# Altium project mcu.PrjPcb (part 2 of 2)

## Sheet misc.SchDoc
size 381 x 241 mm; SheetNumber: 4; SheetTotal: 5
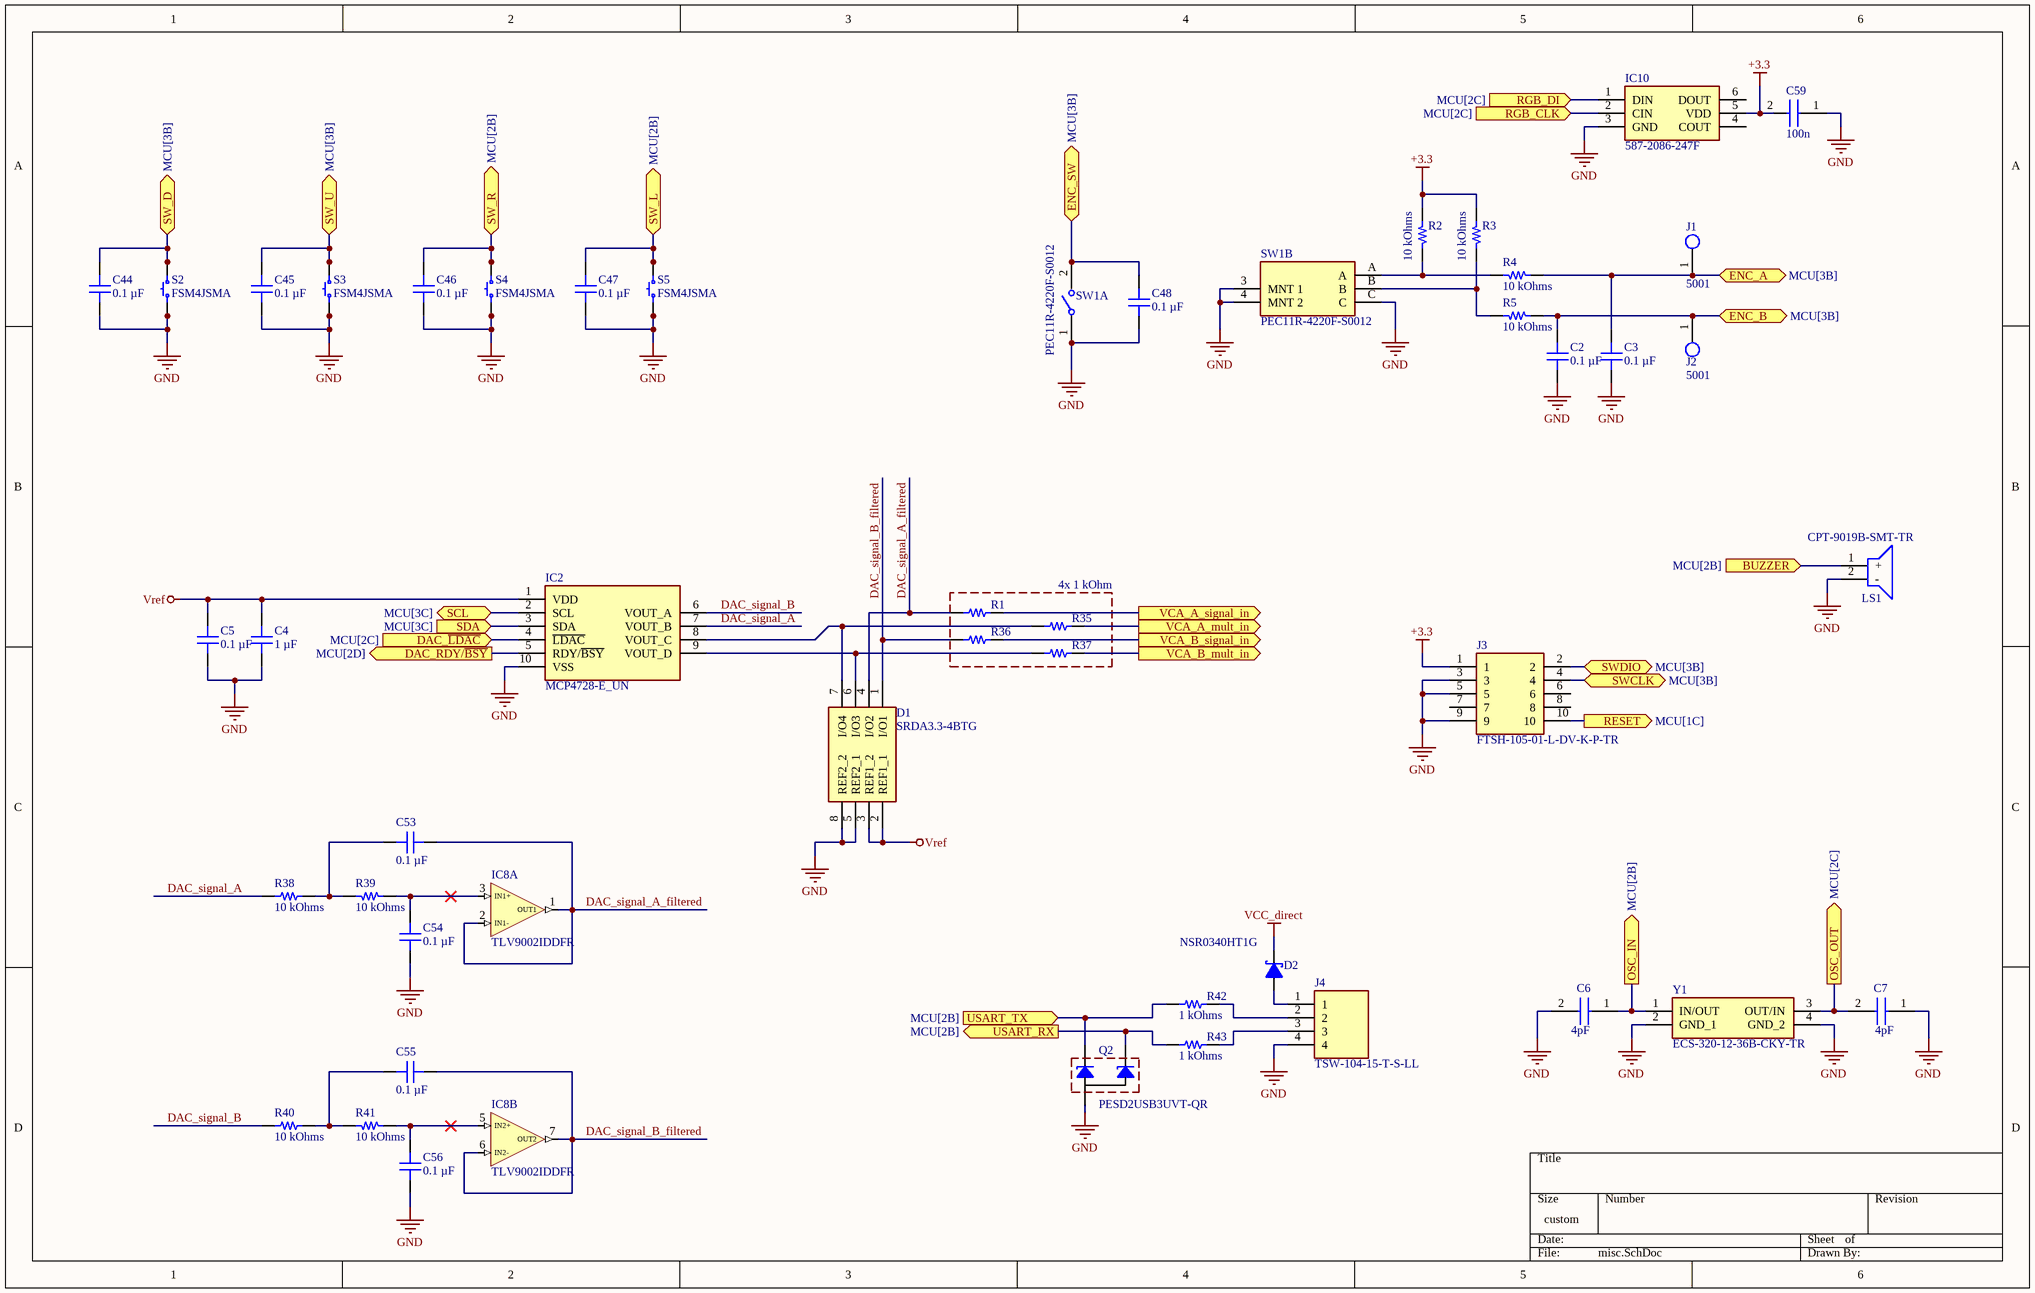
[diagram p3: misc.SchDoc]

### Parts
C2  0.1 µF  [CAP 1206_3216 - 0.8MM]
C3  0.1 µF  [CAP 1206_3216 - 0.8MM]
C4  1 µF  [CAP 1206_3216 - 0.8MM]
C5  0.1 µF  [CAP 1206_3216 - 0.8MM]
C6  4pF  [CAPC1608X80N]
C7  4pF  [CAPC1608X80N]
C44  0.1 µF  [CAP 1206_3216 - 0.8MM]
C45  0.1 µF  [CAP 1206_3216 - 0.8MM]
C46  0.1 µF  [CAP 1206_3216 - 0.8MM]
C47  0.1 µF  [CAP 1206_3216 - 0.8MM]
C48  0.1 µF  [CAP 1206_3216 - 0.8MM]
C53  0.1 µF  [CAP 1206_3216 - 0.8MM]
C54  0.1 µF  [CAP 1206_3216 - 0.8MM]
C55  0.1 µF  [CAP 1206_3216 - 0.8MM]
C56  0.1 µF  [CAP 1206_3216 - 0.8MM]
C59  100n  [C0805]
D1  SRDA3.3-4BTG  [SOIC8-127P600X175-8N]
D2  NSR0340HT1G  [SOD2512X110N]
IC2  MCP4728-E_UN  [SOP50P490X110-10N]
IC8  TLV9002IDDFR  [SOT65P280X110-8N]  (parts A,B of 3)
IC10  587-2086-247F  [5872086247F]
J1  5001  [FP-5001-MFG]
J2  5001  [FP-5001-MFG]
J3  FTSH-105-01-L-DV-K-P-TR  [FTSH-105-XX-YYY-DV-K-P-TR]
J4  TSW-104-15-T-S-LL  [HDRV4W64P254_1X4_1016X241X1575P]
LS1  CPT-9019B-SMT-TR  [CPT9019BSMTTR]
Q2  PESD2USB3UVT-QR  [SOT95P230X110-3N]
R1  1 kOhms  [YAGEO RES 1206_3216]  (value not drawn)
R2  10 kOhms  [YAGEO RES 1206_3216]
R3  10 kOhms  [YAGEO RES 1206_3216]
R4  10 kOhms  [YAGEO RES 1206_3216]
R5  10 kOhms  [YAGEO RES 1206_3216]
R35  1 kOhms  [YAGEO RES 1206_3216]  (value not drawn)
R36  1 kOhms  [YAGEO RES 1206_3216]  (value not drawn)
R37  1 kOhms  [YAGEO RES 1206_3216]  (value not drawn)
R38  10 kOhms  [RES 1206_3216]
R39  10 kOhms  [YAGEO RES 1206_3216]
R40  10 kOhms  [RES 1206_3216]
R41  10 kOhms  [YAGEO RES 1206_3216]
R42  1 kOhms  [YAGEO RES 1206_3216]
R43  1 kOhms  [YAGEO RES 1206_3216]
S2  FSM4JSMA  [TE FSM4JSMA]
S3  FSM4JSMA  [TE FSM4JSMA]
S4  FSM4JSMA  [TE FSM4JSMA]
S5  FSM4JSMA  [TE FSM4JSMA]
SW1  PEC11R-4220F-S0012  [FP-PEC11R-4220F-S0012-MFG]  (parts A,B of 2)
Y1  ECS-320-12-36B-CKY-TR  [ECS240836QAESTR]

### Blocks framed on the sheet
4x 1 kOhm: R1 R35-R37

### Ports
BUZZER (in, see MCU[2B]), DAC_RDY/~{BSY} (out, see MCU[2D]), DAC_~{LDAC} (in, see MCU[2C]), ENC_A (bidir, see MCU[3B]), ENC_B (bidir, see MCU[3B]), ENC_SW (bidir, see MCU[3B]), OSC_IN (out, see MCU[2B]), OSC_OUT (out, see MCU[2C]), RESET (out, see MCU[1C]), RGB_CLK (in, see MCU[2C]), RGB_DI (in, see MCU[2C]), SCL (bidir, see MCU[3C]), SDA (in, see MCU[3C]), SW_D (bidir, see MCU[3B]), SW_L (bidir, see MCU[2B]), SW_R (bidir, see MCU[2B]), SW_U (bidir, see MCU[3B]), SWCLK (bidir, see MCU[3B]), SWDIO (bidir, see MCU[3B]), USART_RX (out, see MCU[2B]), USART_TX (in, see MCU[2B]), VCA_A_mult_in (out), VCA_A_signal_in (out), VCA_B_mult_in (out), VCA_B_signal_in (out)

### Nets
+3.3: C59.2 IC10.5(VDD) J3.1 R2.1 R3.1
GND: C2.1 C3.1 C4.1 C5.1 C6.2 C7.1 C44.1 C45.1 C46.1 C47.1 C48.1 C54.2 C56.2 C59.1 D1.5(REF2_1) D1.8(REF2_2) IC2.10(VSS) IC10.3(GND) J3.3 J3.5 J3.9 J4.4 LS1.2(-) Q2.3(CA) S2.1 S2.2 S3.1 S3.2 S4.1 S4.2 S5.1 S5.2 SW1.1 SW1.3(MNT_1) SW1.4(MNT_2) SW1.C Y1.2(GND_1) Y1.4(GND_2)
VCC_direct: D2.1(C)
Vref: C4.2 C5.2 D1.2(REF1_1) D1.3(REF1_2) IC2.1(VDD)
DAC_signal_A: IC2.7(VOUT_B) R38.1
DAC_signal_A_filtered: C53.1 D1.4(I/O2) IC8.1(OUT1) IC8.2(IN1-) R1.2
DAC_signal_B: IC2.6(VOUT_A) R40.1
DAC_signal_B_filtered: C55.1 D1.1(I/O1) IC8.6(IN2-) IC8.7(OUT2) R36.2
NetC1_2: J3.10 ; port RESET
NetC2_2: C2.2 J2.1 R5.2 ; port ENC_B
NetC3_2: C3.2 J1.1 R4.2 ; port ENC_A
NetC6_1: C6.1 Y1.1(IN/OUT) ; port OSC_IN
NetC7_2: C7.2 Y1.3(OUT/IN) ; port OSC_OUT
NetC44_2: C44.2 S2.3 S2.4 ; port SW_D
NetC45_2: C45.2 S3.3 S3.4 ; port SW_U
NetC46_2: C46.2 S4.3 S4.4 ; port SW_R
NetC47_2: C47.2 S5.3 S5.4 ; port SW_L
NetC48_2: C48.2 SW1.2 ; port ENC_SW
NetC53_2: C53.2 R38.2 R39.2
NetC54_1: C54.1 IC8.3(IN1+) R39.1
NetC55_2: C55.2 R40.2 R41.2
NetC56_1: C56.1 IC8.5(IN2+) R41.1
NetD1_6: D1.6(I/O3) IC2.9(VOUT_D) R37.2
NetD1_7: D1.7(I/O4) IC2.8(VOUT_C) R35.2
NetD2_2: D2.2(A) J4.1
NetIC1_1: LS1.1(+) ; port BUZZER
NetIC1_11: IC10.1(DIN) ; port RGB_DI
NetIC1_12: IC10.2(CIN) ; port RGB_CLK
NetIC1_13: IC2.4(~{LDAC}) ; port DAC_~{LDAC}
NetIC1_14: IC2.5(RDY/~{BSY}) ; port DAC_RDY/~{BSY}
NetIC1_25: IC2.2(SCL) ; port SCL
NetIC1_26: IC2.3(SDA) ; port SDA
NetIC1_35: J3.2 ; port SWDIO
NetIC1_36: J3.4 ; port SWCLK
NetIC1_45: Q2.1(K1) R42.2 ; port USART_TX
NetIC1_46: Q2.2(K2) R43.2 ; port USART_RX
NetJ4_2: J4.2 R42.1
NetJ4_3: J4.3 R43.1
NetR1_1: R1.1 ; port VCA_A_signal_in
NetR2_2: R2.2 R4.1 SW1.A
NetR3_2: R3.2 R5.1 SW1.B
NetR35_1: R35.1 ; port VCA_A_mult_in
NetR36_1: R36.1 ; port VCA_B_signal_in
NetR37_1: R37.1 ; port VCA_B_mult_in

Not connected (* = marked no-connect by the designer): IC10 4(COUT) 6(DOUT); J3 6 7 8

### Library data of the parts
C2 C3 C5 C44-C48 C53-C56 = 885012208087: CAP CER 0.1UF 50V X7R 1206; manufacturer: Würth Elektronik; Tolerance: ±10%; Part Number: 885012208087; Capacitance: 0.1 µF; Applications: General Purpose; componentlink1description: Datasheet; componentlink1url: https://katalog.we-online.de/pbs/datasheet/885012208087.pdf; componentlink2description: DigiKey Link; componentlink2url: https://www.digikey.com/en/products/detail/würth-elektronik/885012208087/5453982; Device Package: 1206 (3216 Metric); lastupdated: 6/4/2024 19:10:27; Lifecycle Status: Active; Minimum Order: 1; Mounting Type: Surface Mount, MLCC; Operating Temperature: -55°C ~ 125°C; Package / Case: 1206 (3216 Metric); packaging: TapeAndReel; partid: 20879; Part Status: Active; price: 0.06; series: WCAP-CSGP; Size / Dimension: 0.126" L x 0.063" W (3.20mm x 1.60mm); Supplier 1: DigiKey; Supplier Part Number 1: 732-8127-1-ND; Temperature Coefficient: X7R; Thickness (Max): 0.035" (0.90mm); value: 0.1 µF; Voltage - Rated: 50V
C4 = 885012208093: CAP CER 1UF 50V X7R 1206; manufacturer: Würth Elektronik; Tolerance: ±10%; Part Number: 885012208093; Capacitance: 1 µF; Applications: General Purpose; componentlink1description: Datasheet; componentlink1url: https://katalog.we-online.de/pbs/datasheet/885012208093.pdf; componentlink2description: DigiKey Link; componentlink2url: https://www.digikey.com/en/products/detail/würth-elektronik/885012208093/5453432; Device Package: 1206 (3216 Metric); lastupdated: 6/4/2024 19:10:33; Lifecycle Status: Active; Minimum Order: 1; Mounting Type: Surface Mount, MLCC; Operating Temperature: -55°C ~ 125°C; Package / Case: 1206 (3216 Metric); packaging: TapeAndReel; partid: 39665; Part Status: Active; price: 0.10; series: WCAP-CSGP; Size / Dimension: 0.126" L x 0.063" W (3.20mm x 1.60mm); Supplier 1: DigiKey; Supplier Part Number 1: 732-7577-1-ND; Temperature Coefficient: X7R; Thickness (Max): 0.075" (1.90mm); value: 1 µF; Voltage - Rated: 50V
C6 C7 = C1608C0G1H040C080AA: Capacitor; Manufacturer_Name: TDK; Datasheet Link: https://product.tdk.com/info/en/catalog/datasheets/mlcc_commercial_midvoltage_en.pdf; Height: 0.8mm; Manufacturer_Part_Number: C1608C0G1H040C080AA; Arrow Part Number: C1608C0G1H040C080AA; Arrow Price/Stock: https://www.arrow.com/en/products/c1608c0g1h040c080aa/tdk
C59 = C0805C104K3RACTU: Capacitor; Manufacturer_Name: KEMET; Datasheet Link: https://content.kemet.com/datasheets/KEM_C1002_X7R_SMD.pdf; Height: 1.1mm; Manufacturer_Part_Number: C0805C104K3RACTU; Mouser Part Number: 80-C0805C104K3R; Mouser Price/Stock: https://www.mouser.co.uk/ProductDetail/KEMET/C0805C104K3RACTU?qs=zZwvocWqSRjmUvfNxkIN%2Fg%3D%3D; Arrow Part Number: C0805C104K3RACTU; Arrow Price/Stock: https://www.arrow.com/en/products/c0805c104k3ractu/kemet-corporation
D1 = SRDA3.3-4BTG: TVS Diode (Bi-directional); Manufacturer_Name: LITTELFUSE; Datasheet Link: https://www.littelfuse.com/~/media/electronics/datasheets/tvs_diode_arrays/littelfuse_tvs_diode_array_srda3_3_datasheet.pdf.pdf; Height: 1.75mm; Manufacturer_Part_Number: SRDA3.3-4BTG; Mouser Part Number: 576-SRDA3.3-4BTG; Mouser Price/Stock: https://www.mouser.co.uk/ProductDetail/Littelfuse/SRDA3.3-4BTG?qs=wqPJ3MBjhrh9DaqZL3Nnvw%3D%3D; Arrow Part Number: SRDA3.3-4BTG; Arrow Price/Stock: https://www.arrow.com/en/products/srda3.3-4btg/littelfuse?utm_currency=USD&region=nac
D2 = NSR0340HT1G: Diode; Manufacturer_Name: onsemi; Datasheet Link: https://www.onsemi.com/pub/Collateral/NSR0340H-D.PDF; Height: 1.1mm; Manufacturer_Part_Number: NSR0340HT1G; Mouser Part Number: 863-NSR0340HT1G; Mouser Price/Stock: https://www.mouser.co.uk/ProductDetail/onsemi/NSR0340HT1G?qs=agb4oTp1Mj%2FMC6G4Sgc%2FTQ%3D%3D; Arrow Part Number: NSR0340HT1G; Arrow Price/Stock: https://www.arrow.com/en/products/nsr0340ht1g/on-semiconductor?utm_currency=USD&region=nac
IC2 = MCP4728-E_UN: Integrated Circuit; Manufacturer_Name: Microchip; Manufacturer_Part_Number: MCP4728-E/UN; Datasheet Link: http://ww1.microchip.com/downloads/en/DeviceDoc/22187E.pdf; Height: 1.1mm; Mouser Part Number: 579-MCP4728-E/UN; Mouser Price/Stock: https://www.mouser.co.uk/ProductDetail/Microchip-Technology/MCP4728-E-UN?qs=E6wAi2XWqcP2zTenScklGA%3D%3D; Arrow Part Number: MCP4728-E/UN; Arrow Price/Stock: https://www.arrow.com/en/products/mcp4728-eun/microchip-technology?utm_currency=USD&region=nac
IC8 = TLV9002IDDFR: Integrated Circuit; Manufacturer_Name: Texas Instruments; Datasheet Link: https://www.ti.com/lit/gpn/TLV9002; Height: 1.1mm; Manufacturer_Part_Number: TLV9002IDDFR; Mouser Part Number: 595-TLV9002IDDFR; Mouser Price/Stock: https://www.mouser.co.uk/ProductDetail/Texas-Instruments/TLV9002IDDFR?qs=mAH9sUMRCtuVJ6NmNV%252Bgrw%3D%3D; Arrow Part Number: TLV9002IDDFR; Arrow Price/Stock: https://www.arrow.com/en/products/tlv9002iddfr/texas-instruments?utm_currency=USD&region=nac
IC10 = 587-2086-247F: Integrated Circuit; Manufacturer_Name: Dialight; Datasheet Link: https://s3-us-west-2.amazonaws.com/catsy.557/Dialight_datasheet_587-2086-247F_Addressable_RGB.pdf; Height: 1mm; Manufacturer_Part_Number: 587-2086-247F; Mouser Part Number: 645-587-2086-247F; Mouser Price/Stock: https://www.mouser.co.uk/ProductDetail/Dialight/587-2086-247F?qs=iLKYxzqNS76TDIp9wEi56Q%3D%3D
J1 J2 = CMP-2000-05181-2: PC TEST POINT MINIATURE BLACK; Body Material: Bronze; Plating: Silver; Inside Diameter: 1.27mm; Hole Diameter: 1.6mm; Number of Ports: 1; Outside Diameter: 2.54mm; Insulation: Insulated; Insulation Material: Nylon; Mount: Through Hole; RoHS Compliant: Yes; Series: THM; Height: 0.3inch; Termination: Through Hole; Material: Nylon; Packaging: Bulk; Contact Material: Bronze; REACH SVHC: No SVHC; Contact Plating: Silver; Orientation: Straight; Lead Free: Lead Free; Package Quantity: 100; Length: 7.62mm; Flammability Rating: UL94 V-0; Number of Contacts: 1; Diameter: 2.54mm; Housing Color: Black; Color: Black
J3 = FTSH-105-01-L-DV-K-P-TR: Connector; Manufacturer_Name: SAMTEC; Datasheet Link: http://suddendocs.samtec.com/prints/ftsh-1xx-xx-xxx-dv-xxx-xxx-mkt.pdf; Manufacturer_Part_Number: FTSH-105-01-L-DV-K-P-TR; Mouser Part Number: 200-FTSH10501LDVKPTR; Mouser Price/Stock: https://www.mouser.co.uk/ProductDetail/Samtec/FTSH-105-01-L-DV-K-P-TR?qs=fnpEE5GccuMUjCRgxv4voQ%3D%3D; Arrow Part Number: FTSH-105-01-L-DV-K-P-TR; Arrow Price/Stock: https://www.arrow.com/en/products/ftsh-105-01-l-dv-k-p-tr/samtec?utm_currency=USD&region=europe
J4 = TSW-104-15-T-S-LL: Connector; Manufacturer_Name: SAMTEC; Datasheet Link: http://suddendocs.samtec.com/catalog_english/tsw_th.pdf; Height: 15.75mm; Manufacturer_Part_Number: TSW-104-15-T-S-LL; Mouser Part Number: 200-TSW10415TSLL; Mouser Price/Stock: https://www.mouser.co.uk/ProductDetail/Samtec/TSW-104-15-T-S-LL?qs=rU5fayqh%252BE1Oq%252BEC9ZwiVQ%3D%3D
LS1 = CPT-9019B-SMT-TR: Loudspeaker or Buzzer; Manufacturer_Name: Same Sky; Datasheet Link: https://www.sameskydevices.com/product/resource/supplyframepdf/cpt-9019b-smt-tr.pdf; Height: 2.1mm; Manufacturer_Part_Number: CPT-9019B-SMT-TR; Mouser Part Number: 179-CPT-9019B-SMT-TR; Mouser Price/Stock: https://www.mouser.co.uk/ProductDetail/CUI-Devices/CPT-9019B-SMT-TR?qs=3Rah4i%252BhyCGQOzp5C27TLw%3D%3D
Q2 = PESD2USB3UVT-QR: Transistor; Manufacturer_Name: Nexperia; Datasheet Link: https://assets.nexperia.com/documents/data-sheet/PESD2USB3UVT-Q.pdf; Height: 1.1mm; Manufacturer_Part_Number: PESD2USB3UVT-QR; Mouser Part Number: 771-PESD2USB3UVT-QR; Mouser Price/Stock: https://www.mouser.co.uk/ProductDetail/Nexperia/PESD2USB3UVT-QR?qs=3Rah4i%252BhyCFPJOQFghMZ%252BQ%3D%3D; Arrow Part Number: PESD2USB3UVT-QR; Arrow Price/Stock: https://www.arrow.com/en/products/pesd2usb3uvt-qr/nexperia?utm_currency=USD&region=europe
R1 R35-R37 R42 R43 = RT1206FRE071KL: RES SMD 1K OHM 1% 1/4W 1206; Manufacturer: Yageo; Power (Watts): 0.25W, 1/4W; Temperature Coefficient: ±50ppm/°C; Part Number: RT1206FRE071KL; ComponentLink1Description: Datasheet; ComponentLink1URL: https://www.yageo.com/upload/media/product/productsearch/datasheet/rchip/PYu-RT_1-to-0.01_RoHS_L_11.pdf; ComponentLink2Description: DigiKey Link; ComponentLink2URL: https://www.digikey.com/en/products/detail/yageo/RT1206FRE071KL/1083016; Composition: Thin Film; Device Package: 1206 (3216 Metric); Height - Seated (Max): 0.026" (0.65mm); LastUpdated: 7/25/2024 09:21:27; Lifecycle Status: Active; Minimum Order: 1; Number of Terminations: 2; Operating Temperature: -55°C ~ 155°C; Package / Case: 1206 (3216 Metric); Packaging: TapeAndReel; PartId: 40465; Part Status: Active; Price: 0.01; Resistance: 1 kOhms; Series: RT; Size / Dimension: 0.122" L x 0.063" W (3.10mm x 1.60mm); Supplier 1: DigiKey; Supplier Part Number 1: YAG3366CT-ND; Supplier Device Package: 1206; Tolerance: ±1%; Value: 1 kOhms
R2-R5 R39 R41 = RT1206FRE0710KL: RES SMD 10K OHM 1% 1/4W 1206; Manufacturer: Yageo; Power (Watts): 0.25W, 1/4W; Temperature Coefficient: ±50ppm/°C; Part Number: RT1206FRE0710KL; ComponentLink1Description: Datasheet; ComponentLink1URL: https://www.yageo.com/upload/media/product/productsearch/datasheet/rchip/PYu-RT_1-to-0.01_RoHS_L_11.pdf; ComponentLink2Description: DigiKey Link; ComponentLink2URL: https://www.digikey.com/en/products/detail/yageo/RT1206FRE0710KL/1082868; Composition: Thin Film; Device Package: 1206 (3216 Metric); Height - Seated (Max): 0.026" (0.65mm); LastUpdated: 7/25/2024 09:21:28; Lifecycle Status: Active; Minimum Order: 1; Number of Terminations: 2; Operating Temperature: -55°C ~ 155°C; Package / Case: 1206 (3216 Metric); Packaging: TapeAndReel; PartId: 38903; Part Status: Active; Price: 0.01; Resistance: 10 kOhms; Series: RT; Size / Dimension: 0.122" L x 0.063" W (3.10mm x 1.60mm); Supplier 1: DigiKey; Supplier Part Number 1: YAG1242CT-ND; Supplier Device Package: 1206; Tolerance: ±1%; Value: 10 kOhms
R38 R40 = ERA-8AEB103V: RES SMD 10K OHM 0.1% 1/4W 1206; Manufacturer: Panasonic Electronic Components; Power (Watts): 0.25W, 1/4W; Temperature Coefficient: ±25ppm/°C; Part Number: ERA-8AEB103V; ComponentLink1Description: Datasheet; ComponentLink1URL: https://industrial.panasonic.com/cdbs/www-data/pdf/RDM0000/AOA0000C307.pdf; ComponentLink2Description: DigiKey Link; ComponentLink2URL: https://www.digikey.com/en/products/detail/panasonic-electronic-components/ERA-8AEB103V/3070742; Composition: Thin Film; Device Package: 1206 (3216 Metric); Features: Automotive AEC-Q200; Height - Seated (Max): 0.028" (0.70mm); LastUpdated: 2/9/2024 20:54:17; Lifecycle Status: Active; Minimum Order: 1; Number of Terminations: 2; Operating Temperature: -55°C ~ 155°C; Package / Case: 1206 (3216 Metric); Packaging: TapeAndReel; PartId: 33990; Part Status: Active; Price: 0.10; Ratings: AEC-Q200; Resistance: 10 kOhms; Series: ERA-8A; Size / Dimension: 0.126" L x 0.063" W (3.20mm x 1.60mm); Supplier 1: DigiKey; Supplier Part Number 1: P10KBCCT-ND; Supplier Device Package: 1206; Tolerance: ±0.1%; Value: 10 kOhms
S2-S5 = FSM4JSMA: SWITCH TACTILE SPST-NO 0.05A 24V; Manufacturer: TE Connectivity ALCOSWITCH Switches; Actuator Height off PCB, Vertical: 5.00mm; Actuator Orientation: Top Actuated; Actuator Type: Standard; Contact Rating @ Voltage: 0.05A @ 24VDC; Illumination: Non-Illuminated; Operating Force: 160gf; Outline: 6.00mm x 6.00mm; Switch Function: Off-Mom; Part Number: FSM4JSMA; Circuit: SPST-NO; ComponentLink1Description: Datasheet; ComponentLink1URL: https://www.te.com/commerce/DocumentDelivery/DDEController?Action=srchrtrv&DocNm=1308111-1_SWITCHES_CORE_PROGRAM_CATALOG&DocType=CS&DocLang=English; ComponentLink2Description: DigiKey Link; ComponentLink2URL: https://www.digikey.com/en/products/detail/te-connectivity-alcoswitch-switches/FSM4JSMA/525821; LastUpdated: 6/3/2024 20:19:31; Lifecycle Status: Active; Minimum Order: 1; Mounting Type: Surface Mount; Operating Temperature: -35°C ~ 85°C; Packaging: Bulk; Part Status: Active; Price: 0.14; Series: FSMJSMA; Supplier 1: DigiKey; Supplier Part Number 1: 450-1129-ND; Termination Style: Gull Wing
SW1 = PEC11R-4220F-S0012: ROTARY ENCODER MECHANICAL 12PPR; Built in Switch: Yes; Number of Channels: 2; Output Type: Quadrature; Hole Diameter: 7mm; Pulses per Revolution: 12; Termination: PC Pin; Package Quantity: 150; RoHS Compliant: Yes; Mount: Through Hole; Width: 12.5mm; Radiation Hardening: No; Number of Pins: 5; REACH SVHC: No SVHC; Type: Mechanical; Packaging: Bulk; Min Operating Temperature: -30°C; Encoder Type: Mechanical; Height: 13.4mm; Length: 26.5mm; Orientation: Vertical; Max Operating Temperature: 70°C; Series: PEC11R; Detent: Yes
Y1 = ECS-320-12-36B-CKY-TR: Crystal or Oscillator; Manufacturer_Name: ECS; Datasheet Link: https://www.ecsxtal.com/store/pdf/ECX-2236B.pdf; Height: 0mm; Manufacturer_Part_Number: ECS-320-12-36B-CKY-TR; Mouser Part Number: 520-320-12-36B-CKYT; Mouser Price/Stock: https://www.mouser.co.uk/ProductDetail/ECS/ECS-320-12-36B-CKY-TR?qs=l7cgNqFNU1juKISosFzRbg%3D%3D; Arrow Part Number: ECS-320-12-36B-CKY-TR; Arrow Price/Stock: https://www.arrow.com/en/products/ecs-320-12-36b-cky-tr/ecs-international

## Sheet LCD.SchDoc
size A; SheetNumber: 5; SheetTotal: 5
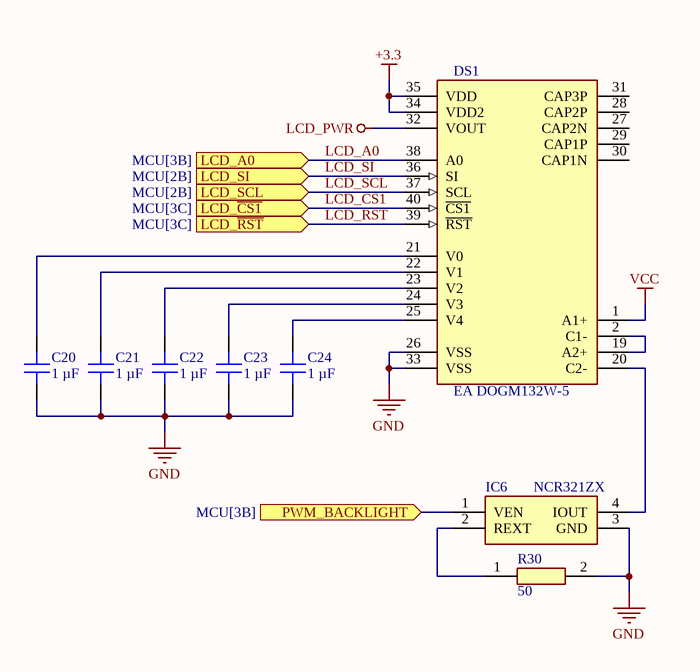
[diagram p4: LCD.SchDoc]

### Parts
C20  1 µF  [CAP 1206_3216 - 0.8MM]
C21  1 µF  [CAP 1206_3216 - 0.8MM]
C22  1 µF  [CAP 1206_3216 - 0.8MM]
C23  1 µF  [CAP 1206_3216 - 0.8MM]
C24  1 µF  [CAP 1206_3216 - 0.8MM]
DS1  EA DOGM132W-5  [FP-EA_DOGM132L-5-MFG]
IC6  NCR321ZX  [SOT230P700X180-4N]
R30  50  [RESC6332X65N]

### Ports
LCD_A0 (in, see MCU[3B]), LCD_SCL (in, see MCU[2B]), LCD_SI (in, see MCU[2B]), LCD_~{CS1} (in, see MCU[3C]), LCD_~{RST} (in, see MCU[3C]), PWM_BACKLIGHT (in, see MCU[3B])

### Nets
+3.3: DS1.34(VDD2) DS1.35(VDD)
GND: C20.1 C21.1 C22.1 C23.1 C24.1 DS1.26(VSS) DS1.33(VSS) IC6.3(GND) R30.2
LCD_PWR: DS1.32(VOUT)
VCC: DS1.1(A1+)
LCD~{_CS}1: DS1.40(~{CS1}) ; port LCD_~{CS1}
LCD~{_RS}T: DS1.39(~{RST}) ; port LCD_~{RST}
LCD_A0: DS1.38(A0) ; port LCD_A0
LCD_SCL: DS1.37(SCL) ; port LCD_SCL
LCD_SI: DS1.36(SI) ; port LCD_SI
NetC20_2: C20.2 DS1.21(V0)
NetC21_2: C21.2 DS1.22(V1)
NetC22_2: C22.2 DS1.23(V2)
NetC23_2: C23.2 DS1.24(V3)
NetC24_2: C24.2 DS1.25(V4)
NetDS1_2: DS1.2(C1-) DS1.19(A2+)
NetDS1_20: DS1.20(C2-) IC6.4(IOUT)
NetIC1_37: IC6.1(VEN) ; port PWM_BACKLIGHT
NetIC6_2: IC6.2(REXT) R30.1

Not connected (* = marked no-connect by the designer): DS1 27(CAP2N) 28(CAP2P) 29(CAP1P) 30(CAP1N) 31(CAP3P)

### Library data of the parts
C20-C24 = 885012208093: as C4 on sheet misc; Part Number: 885012208093; Capacitance: 1 µF; Applications: General Purpose; componentlink1description: Datasheet; componentlink1url: https://katalog.we-online.de/pbs/datasheet/885012208093.pdf; componentlink2description: DigiKey Link; componentlink2url: https://www.digikey.com/en/products/detail/würth-elektronik/885012208093/5453432; Device Package: 1206 (3216 Metric); lastupdated: 6/4/2024 19:10:33; Lifecycle Status: Active; Minimum Order: 1; Mounting Type: Surface Mount, MLCC; Operating Temperature: -55°C ~ 125°C; Package / Case: 1206 (3216 Metric); packaging: TapeAndReel; partid: 39665; Part Status: Active; price: 0.10; series: WCAP-CSGP; Size / Dimension: 0.126" L x 0.063" W (3.20mm x 1.60mm); Supplier 1: DigiKey; Supplier Part Number 1: 732-7577-1-ND; Temperature Coefficient: X7R; Thickness (Max): 0.075" (1.90mm); value: 1 µF; Voltage - Rated: 50V
DS1 = CMP-137185-000001-1: LCD MOD GRAPH 132X32 Y/G; Supply Current: 140uA; Background Color: Green; Resolution (height): 32pixel; Fluid Type: STN POSITIVE; Interface: SPI; Viewing Area (width): 51mm; Resolution (width): 132pixel; Viewing Area (height): 15mm; RoHS Compliant: No; Height: 27.94mm; Min Operating Temperature: -20°C; Packaging: Bulk; Max Operating Temperature: 70°C; Nominal Supply Current: 140uA; Series: EA DOGM; Width: 55mm
IC6 = NCR321ZX: Integrated Circuit; Manufacturer_Name: Nexperia; Datasheet Link: https://componentsearchengine.com/Datasheets/2/NCR321ZX.pdf; Height: 1.8mm; Manufacturer_Part_Number: NCR321ZX; Mouser Part Number: 771-NCR321ZX; Mouser Price/Stock: https://www.mouser.co.uk/ProductDetail/Nexperia/NCR321ZX?qs=ahcBuItHZ3zTr8W8PrL%2FCg%3D%3D; Arrow Part Number: NCR321ZX; Arrow Price/Stock: https://www.arrow.com/en/products/ncr321zx/nexperia?region=nac
R30 = RNCL2512FT50R0: Resistor; Manufacturer_Name: Stackpole Electronics; Datasheet Link: https://www.seielect.com/catalog/sei-rncl.pdf; Height: 0.65mm; Manufacturer_Part_Number: RNCL2512FT50R0; Resistance: 50

## Nets that join several sheets
+3.3: power (11 pins), MCU (IC1.4 IC1.6), misc (5 pins), LCD (DS1.34 DS1.35)
GND: filters (18 pins), power (39 pins), MCU (8 pins), misc (38 pins), LCD (9 pins)
LCD_PWR: power (5 pins), LCD (DS1.32)
VCC: power (10 pins), LCD (DS1.1)
VCC_direct: power (J5.1 Q1.3 R44.1), misc (D2.1)
Vref: filters (6 pins), power (16 pins), MCU (IC1.5), misc (5 pins)
LCD~{_CS}1: MCU (IC1.28), LCD (DS1.40)
LCD~{_RS}T: MCU (IC1.27), LCD (DS1.39)
LCD_A0: MCU (IC1.29), LCD (DS1.38)
LCD_SCL: MCU (IC1.42), LCD (DS1.37)
LCD_SI: MCU (IC1.44), LCD (DS1.36)
NetC1_2: MCU (C1.2 IC1.10 S1.3 S1.4), misc (J3.10)
NetC2_2: MCU (IC1.30), misc (C2.2 J2.1 R5.2)
NetC3_2: MCU (IC1.31), misc (C3.2 J1.1 R4.2)
NetC6_1: MCU (IC1.8), misc (C6.1 Y1.1)
NetC7_2: MCU (IC1.9), misc (C7.2 Y1.3)
NetC8_1: filters (C8.1 IC3.6 IC3.7), MCU (IC1.17)
NetC10_1: filters (C10.1 IC3.1 IC3.2), MCU (IC1.16)
NetC12_1: filters (C12.1 IC4.1 IC4.2), MCU (IC1.22)
NetC14_1: filters (C14.1 IC5.1 IC5.2), MCU (IC1.19)
NetC16_1: filters (C16.1 IC4.6 IC4.7), MCU (IC1.23)
NetC18_1: filters (C18.1 IC5.6 IC5.7), MCU (IC1.20)
NetC44_2: MCU (IC1.38), misc (C44.2 S2.3 S2.4)
NetC45_2: MCU (IC1.39), misc (C45.2 S3.3 S3.4)
NetC46_2: MCU (IC1.41), misc (C46.2 S4.3 S4.4)
NetC47_2: MCU (IC1.40), misc (C47.2 S5.3 S5.4)
NetC48_2: MCU (IC1.33), misc (C48.2 SW1.2)
NetIC1_1: MCU (IC1.1), misc (LS1.1)
NetIC1_11: MCU (IC1.11), misc (IC10.1)
NetIC1_12: MCU (IC1.12), misc (IC10.2)
NetIC1_13: MCU (IC1.13), misc (IC2.4)
NetIC1_14: MCU (IC1.14), misc (IC2.5)
NetIC1_25: MCU (IC1.25), misc (IC2.2)
NetIC1_26: MCU (IC1.26), misc (IC2.3)
NetIC1_34: power (U2.5), MCU (IC1.34)
NetIC1_35: MCU (IC1.35), misc (J3.2)
NetIC1_36: MCU (IC1.36), misc (J3.4)
NetIC1_37: MCU (IC1.37), LCD (IC6.1)
NetIC1_45: MCU (IC1.45), misc (Q2.1 R42.2)
NetIC1_46: MCU (IC1.46), misc (Q2.2 R43.2)